# Altium schematic sheet Branchements.SchDoc
size A4; SheetNumber: 5; SheetTotal: 5
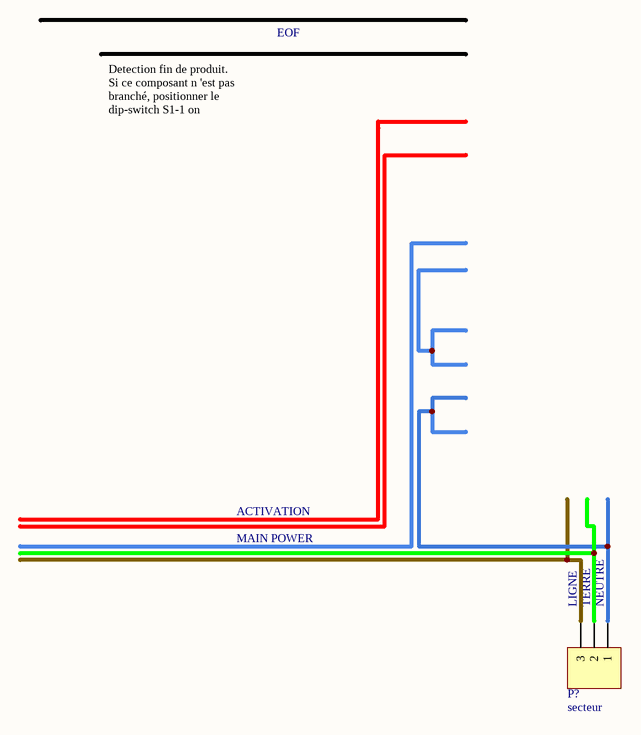
[diagram p0: Branchements.SchDoc]

## Parts
P?  secteur  [HDR1X3]

## Nets

Not connected (* = marked no-connect by the designer): P? 1 2 3

## Notes on the sheet
- EOF
- Detection fin de produit.
  Si ce composant n 'est pas branché, positionner le dip-switch S1-1 on
- MAIN POWER
- ACTIVATION
- (near P?) LIGNE
- (near P?) TERRE
- (near P?) NEUTRE
- Title
- Size:
- Date:
- A4
- Number:
- Time:
- Revision:
- Sheet
- of
- File:

## Library data of the parts
P? = Header 3: Header, 3-Pin; LatestRevisionDate: 17-Jul-2002; LatestRevisionNote: Re-released for DXP Platform.; Publisher: Altium Limited